# EasyEDA schematic SCH_f1c200-board_2024-05-28.json
TITLE: F1C200 Board; REV: 1.0; Date: 2024-05-28; Sheet: 1/1; Drawn By: akash; Company: N/A
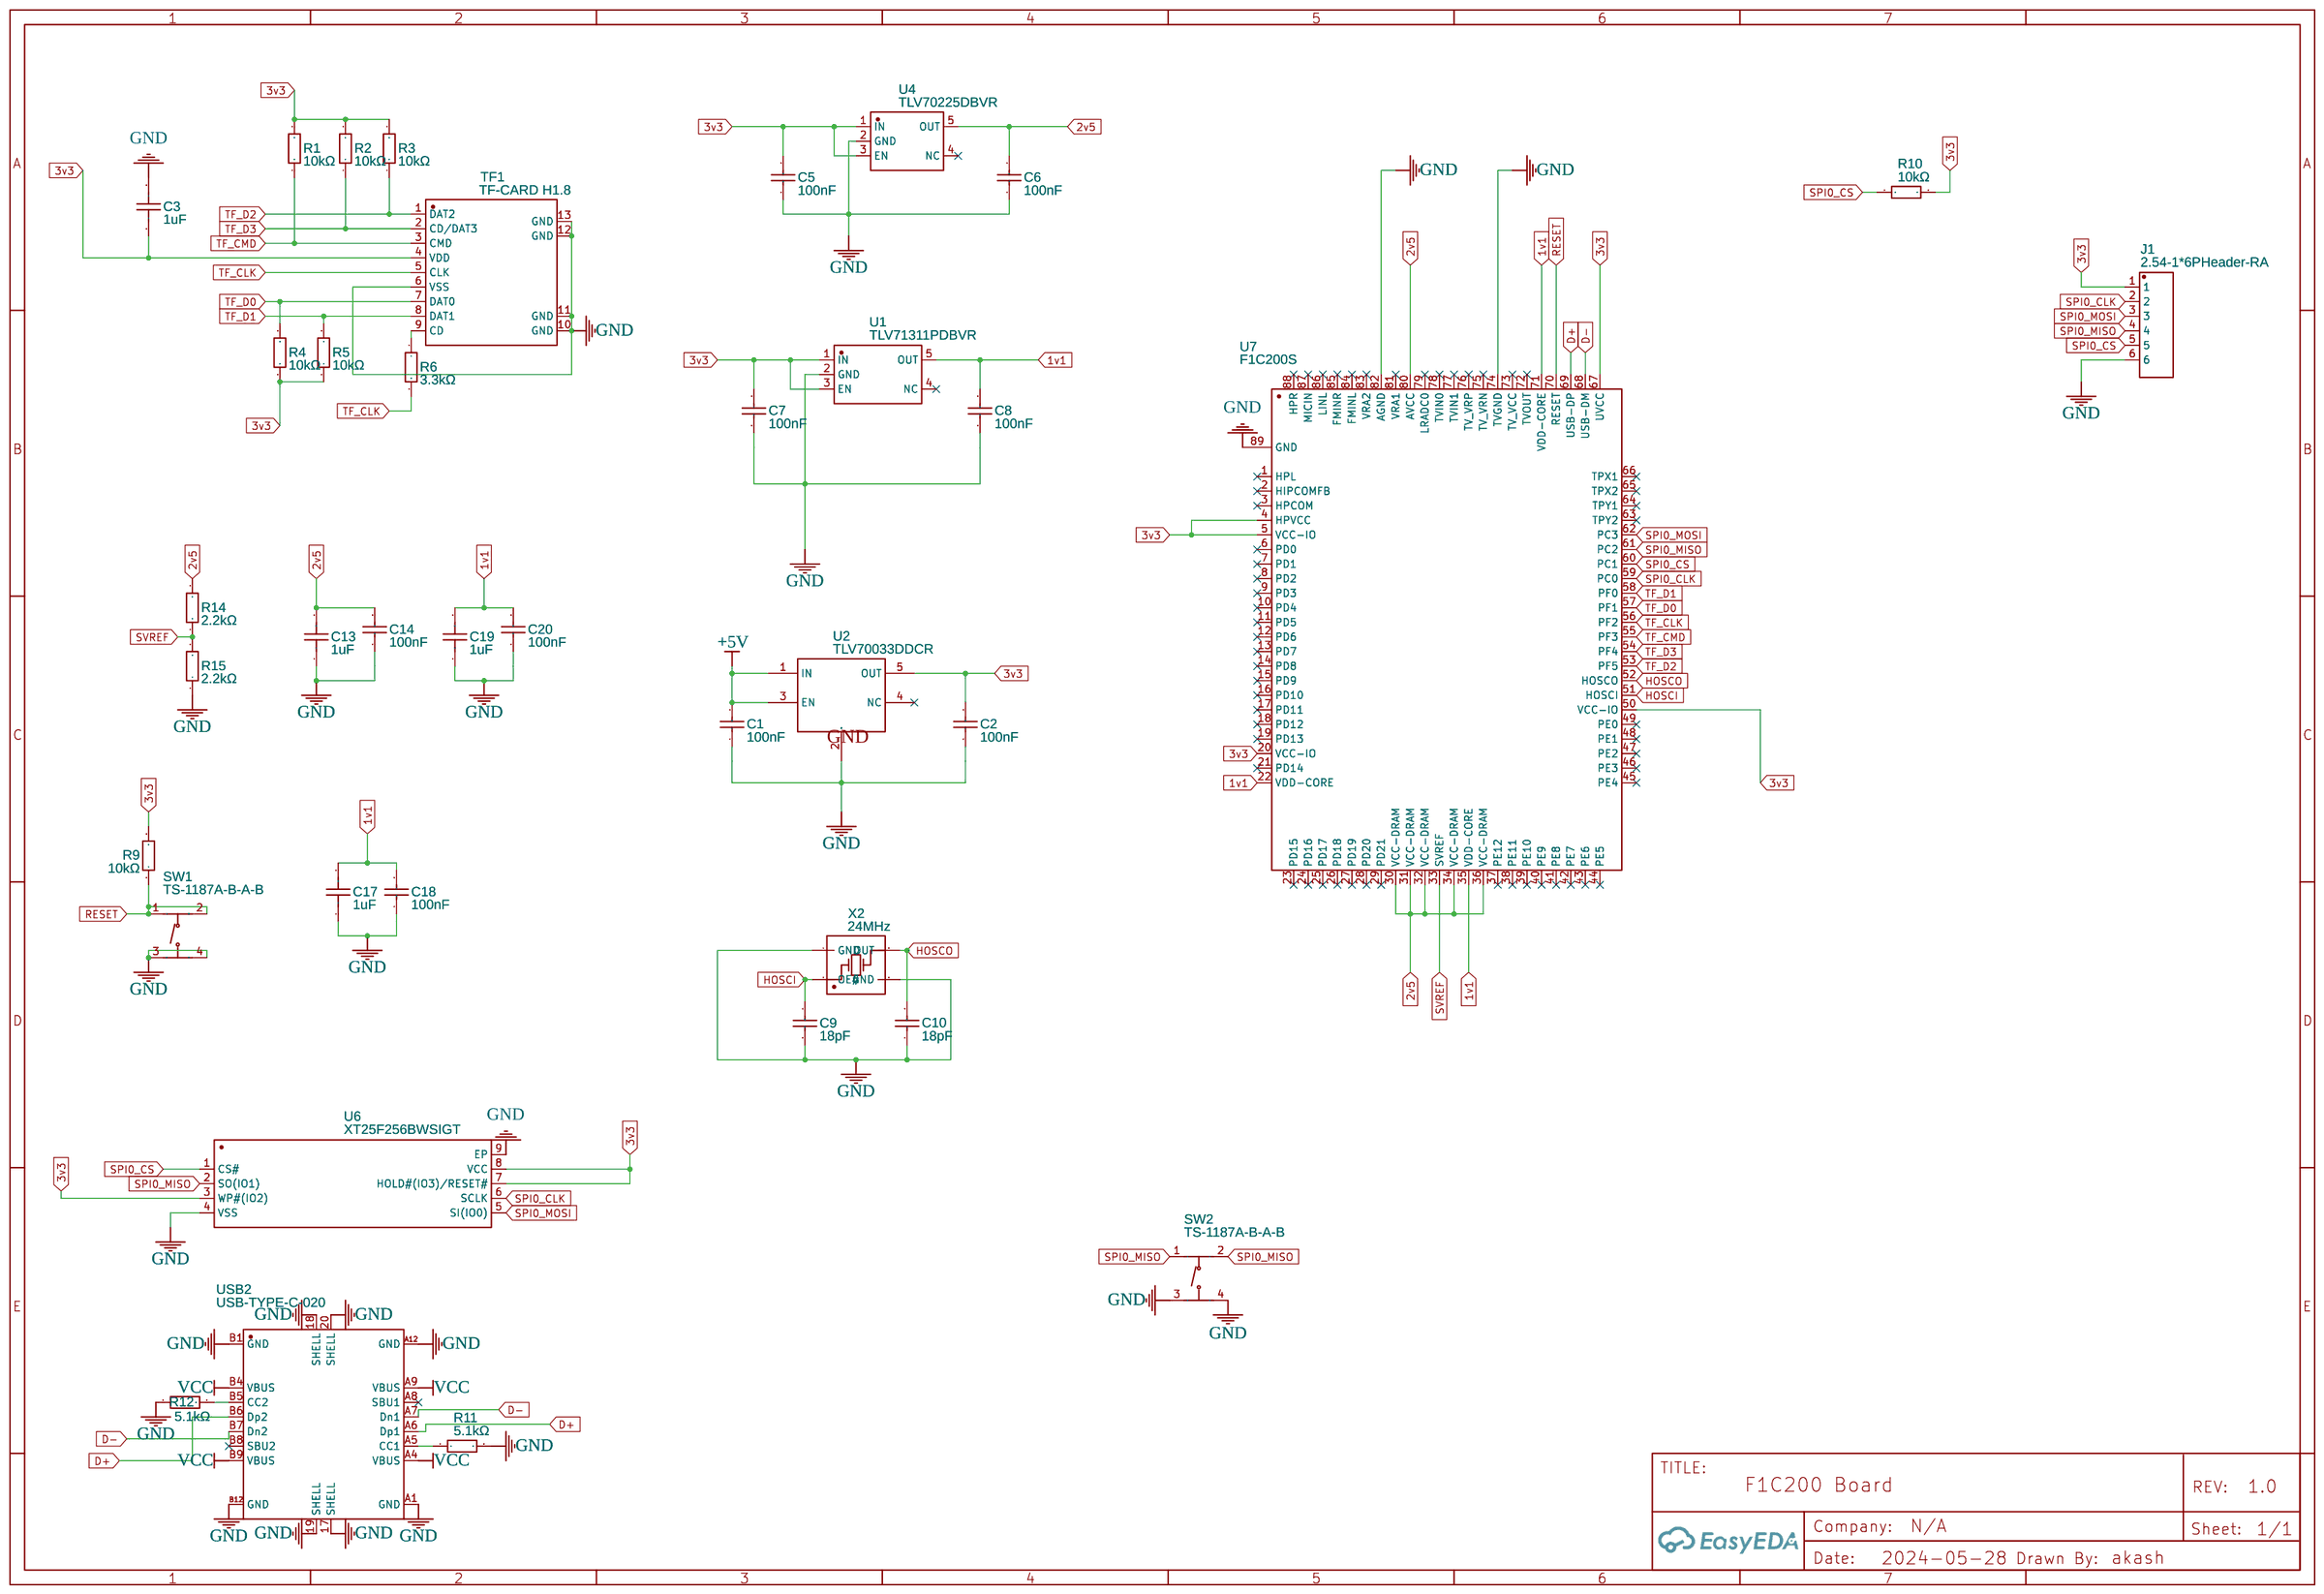
[diagram p0: schematic sheet]

## Parts
C1  100nF  [C0402]
C2  100nF  [C0402]
C3  1uF  [C0402]
C5  100nF  [C0402]
C6  100nF  [C0402]
C7  100nF  [C0402]
C8  100nF  [C0402]
C9  18pF  [C0402]
C10  18pF  [C0402]
C13  1uF  [C0402]
C14  100nF  [C0402]
C17  1uF  [C0402]
C18  100nF  [C0402]
C19  1uF  [C0402]
C20  100nF  [C0402]
J1  2.54-1*6PHeader-RA  [HDR-TH_6P-P2.54-H-M-W10.0]
R1  10kΩ  [R0603]
R2  10kΩ  [R0603]
R3  10kΩ  [R0603]
R4  10kΩ  [R0603]
R5  10kΩ  [R0603]
R6  3.3kΩ  [R0603]
R9  10kΩ  [R0603]
R10  10kΩ  [R0603]
R11  5.1kΩ  [R0402]
R12  5.1kΩ  [R0402]
R14  2.2kΩ  [R0603]
R15  2.2kΩ  [R0603]
SW1  TS-1187A-B-A-B  [SW-SMD_4P-L5.1-W5.1-P3.70-LS6.5-TL-2]
SW2  TS-1187A-B-A-B  [SW-SMD_4P-L5.1-W5.1-P3.70-LS6.5-TL-2]
TF1  TF-CARD H1.8  [TF-SMD_TF-CARD-H1.8]
U1  TLV71311PDBVR  [SOT-23-5_L3.0-W1.7-P0.95-LS2.8-BL]
U2  TLV70033DDCR  [SOT-23-5_L3.0-W1.7-P0.95-LS2.8-BR]
U4  TLV70225DBVR  [SOT-23-5_L2.9-W1.6-P0.95-LS2.8-BR]
U6  XT25F256BWSIGT  [WSON-8_L8.0-W6.0-P1.27-BL-EP]
U7  F1C200S  [QFN-88_L10.0-W10.0-P0.40-BL-EP6.75]
USB2  USB-TYPE-C-020  [USB-SMD_USB-TYPE-C-020]
X2  24MHz  [OSC-SMD_4P-L3.2-W2.5-BL]

## Library data of the parts
C1 C2 C5-C8 C14 C18 C20 = CL05B104KO5NNNC: Supplier: LCSC; Manufacturer: SAMSUNG(三星); Supplier Part: C1525; JLCPCB Part Class: Basic Part
C3 C13 C17 C19 = CL05A105KA5NQNC: Supplier: LCSC; Manufacturer: SAMSUNG(三星); Supplier Part: C52923; JLCPCB Part Class: Basic Part
C9 C10 = 0402CG180J500NT: Supplier: LCSC; Manufacturer: FH(风华); Supplier Part: C1549; JLCPCB Part Class: Basic Part
J1 = 2.54-1*6PHeader-RA: Supplier: LCSC; Manufacturer: BOOMELE(博穆精密); Manufacturer Part: 2.54-1*6P反弯排针; Supplier Part: C56816; JLCPCB Part Class: Extended Part
R1-R5 R9 R10 = 0603WAF1002T5E: Supplier: LCSC; Manufacturer: UNI-ROYAL(厚声); Supplier Part: C25804; JLCPCB Part Class: Basic Part
R6 = 0603WAF3301T5E: Supplier: LCSC; Manufacturer: UNI-ROYAL(厚声); Supplier Part: C22978; JLCPCB Part Class: Basic Part
R11 R12 = 0402WGF5101TCE: Supplier: LCSC; Manufacturer: UNI-ROYAL(厚声); Supplier Part: C25905; JLCPCB Part Class: Basic Part
R14 R15 = 0603WAF2201T5E: Supplier: LCSC; Manufacturer: UNI-ROYAL(厚声); Supplier Part: C4190; JLCPCB Part Class: Basic Part
SW1 SW2 = TS-1187A-B-A-B: Contributor: LCSC; Supplier: LCSC; Supplier Part: C318884; Manufacturer: XKB Connectivity(中国星坤); JLCPCB Part Class: Basic Part
TF1 = TF-CARD H1.8: Supplier: LCSC; Supplier Part: C7529389; Manufacturer: SHOU HAN(首韩); Contributor: lcsc; JLCPCB Part Class: Extended Part
U1 = TLV71311PDBVR: Contributor: LCSC; Supplier: LCSC; Supplier Part: C205964; Manufacturer: TI(德州仪器); JLCPCB Part Class: Extended Part
U2 = TLV70033DDCR: Supplier: LCSC; Manufacturer: TI(德州仪器); Supplier Part: C11337; JLCPCB Part Class: Extended Part
U4 = TLV70225DBVR: Contributor: lcsc; Supplier: LCSC; Supplier Part: C2877849; Manufacturer: TI(德州仪器); JLCPCB Part Class: Extended Part
U6 = XT25F256BWSIGT: Contributor: LCSC; Supplier: LCSC; Supplier Part: C2759959; Manufacturer: XTX(芯天下); JLCPCB Part Class: Extended Part; link: https://lcsc.com/eda_search?q=C2759959&%26type=1&ref=editor
U7 = F1C200S: Contributor: LCSC; Supplier: LCSC; Supplier Part: C2879851; Manufacturer: Allwinner(全志); JLCPCB Part Class: Extended Part
USB2 = USB-TYPE-C-020: Supplier: LCSC; Supplier Part: C2927040; Manufacturer: DEALON(德艺隆); Contributor: lcsc
X2 = 7U24000E12UCG: Contributor: LCSC; Supplier: LCSC; Supplier Part: C251612; Manufacturer: SJK(晶科鑫); JLCPCB Part Class: Extended Part

## Nets
1v1: C8.2 C17.2 C18.2 C19.2 C20.2 U1.5(OUT) U7.22(VDD-CORE) U7.35(VDD-CORE) U7.71(VDD-CORE)
2v5: C6.2 C13.2 C14.2 R14.2 U4.5(OUT) U7.30(VCC-DRAM) U7.31(VCC-DRAM) U7.32(VCC-DRAM) U7.34(VCC-DRAM) U7.36(VCC-DRAM) U7.80(AVCC)
3v3: C2.2 C3.1 C5.2 C7.2 J1.1 R1.2 R2.2 R3.2 R4.1 R5.1 R9.2 R10.2 TF1.4(VDD) U1.1(IN) U1.3(EN) U2.5(OUT) U4.1(IN) U4.3(EN) U6.3(WP#(IO2)) U6.7(HOLD#(IO3)/RESET#) U6.8(VCC) U7.4(HPVCC) U7.5(VCC-IO) U7.20(VCC-IO) U7.50(VCC-IO) U7.67(UVCC)
+5V: C1.2 U2.1(IN) U2.3(EN)
GND: C1.1 C2.1 C3.2 C5.1 C6.1 C7.1 C8.1 C9.1 C10.1 C13.1 C14.1 C17.1 C18.1 C19.1 C20.1 J1.6 R11.2 R12.1 R15.1 SW1.3(C) SW1.4(D) SW2.3(C) SW2.4(D) TF1.6(VSS) TF1.10(GND) TF1.11(GND) TF1.12(GND) TF1.13(GND) U1.2(GND) U2.2(GND) U4.2(GND) U6.4(VSS) U6.9(EP) U7.74(TVGND) U7.82(AGND) U7.89(GND) USB2.17(SHELL) USB2.18(SHELL) USB2.19(SHELL) USB2.20(SHELL) USB2.A1(GND) USB2.A12(GND) USB2.B1(GND) USB2.B12(GND) X2.2(GND) X2.4(GND)
VCC: USB2.A4(VBUS) USB2.A9(VBUS) USB2.B4(VBUS) USB2.B9(VBUS)
D+: U7.69(USB-DP) USB2.A6(Dp1) USB2.B6(Dp2)
D-: U7.68(USB-DM) USB2.A7(Dn1) USB2.B7(Dn2)
HOSCI: C9.2 U7.51(HOSCI) X2.1(OE#)
HOSCO: C10.2 U7.52(HOSCO) X2.3(OUT)
RESET: R9.1 SW1.1(A) SW1.2(B) U7.70(RESET)
SPI0_CLK: J1.2 U6.6(SCLK) U7.59(PC0)
SPI0_CS: J1.5 R10.1 U6.1(CS#) U7.60(PC1)
SPI0_MISO: J1.4 SW2.1(A) SW2.2(B) U6.2(SO(IO1)) U7.61(PC2)
SPI0_MOSI: J1.3 U6.5(SI(IO0)) U7.62(PC3)
SVREF: R14.1 R15.2 U7.33(SVREF)
TF_CLK: R6.2 TF1.5(CLK) U7.56(PF2)
TF_CMD: R1.1 TF1.3(CMD) U7.55(PF3)
TF_D0: R4.2 TF1.7(DAT0) U7.57(PF1)
TF_D1: R5.2 TF1.8(DAT1) U7.58(PF0)
TF_D2: R3.1 TF1.1(DAT2) U7.53(PF5)
TF_D3: R2.1 TF1.2(CD/DAT3) U7.54(PF4)
Net-(R6-1): R6.1 TF1.9(CD)
Net-(R11-1): R11.1 USB2.A5(CC1)
Net-(R12-2): R12.2 USB2.B5(CC2)

Not connected (* = marked no-connect by the designer): U1 4(NC)*; U2 4(NC)*; U4 4(NC)*; U7 1(HPL)* 2(HIPCOMFB)* 3(HPCOM)* 6(PD0)* 7(PD1)* 8(PD2)* 9(PD3)* 10(PD4)* 11(PD5)* 12(PD6)* 13(PD7)* 14(PD8)* 15(PD9)* 16(PD10)* 17(PD11)* 18(PD12)* 19(PD13)* 21(PD14)* 23(PD15)* 24(PD16)* 25(PD17)* 26(PD18)* 27(PD19)* 28(PD20)* 29(PD21)* 37(PE12)* 38(PE11)* 39(PE10)* 40(PE9)* 41(PE8)* 42(PE7)* 43(PE6)* 44(PE5)* 45(PE4)* 46(PE3)* 47(PE2)* 48(PE1)* 49(PE0)* 63(TPY2)* 64(TPY1)* 65(TPX2)* 66(TPX1)* 72(TVOUT)* 73(TV_VCC)* 75(TV_VRN)* 76(TV_VRP)* 77(TVIN1)* 78(TVIN0)* 79(LRADC0)* 81(VRA1)* 83(VRA2)* 84(FMINL)* 85(FMINR)* 86(LINL)* 87(MICIN)* 88(HPR)*; USB2 A8(SBU1)* B8(SBU2)*
